# EAGLE design digimax-dual-IDE64 (EAGLE 4.13)
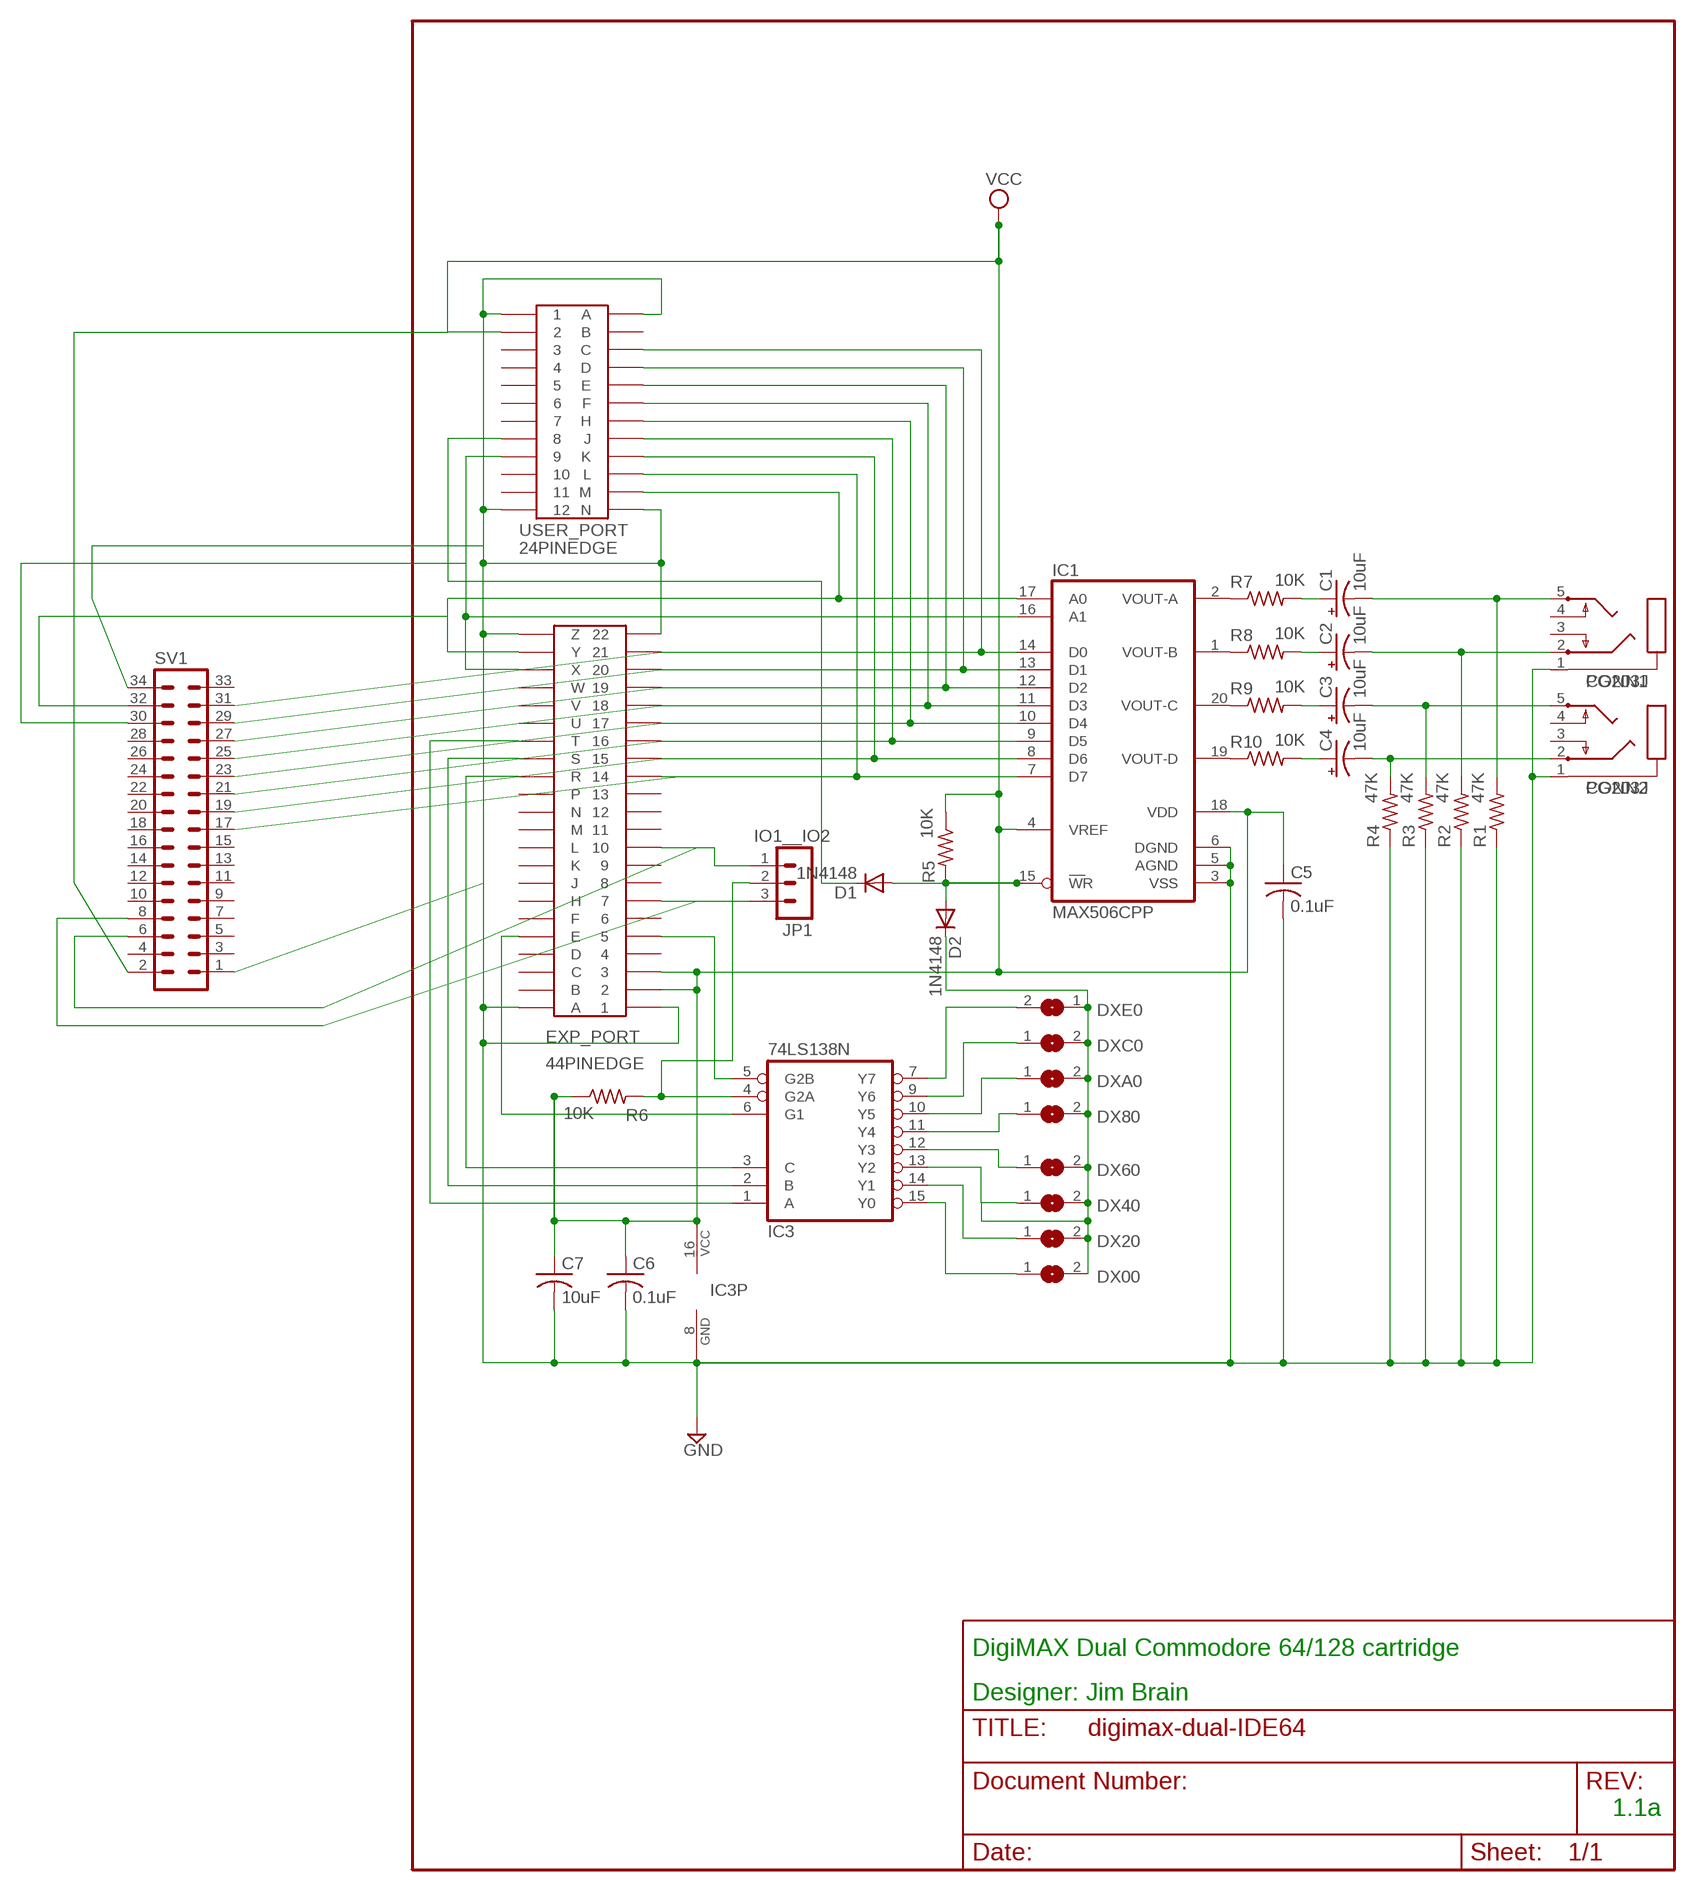
[diagram p0: schematic, sheet 1]

## Parts
C1  10uF  CPOL-USE2-4  [E2-4]
C2  10uF  CPOL-USE2-4  [E2-4]
C3  10uF  CPOL-USE2-4  [E2-4]
C4  10uF  CPOL-USE2-4  [E2-4]
C5  0.1uF  C-US025-024X044  [C025-024X044]
C6  0.1uF  C-US025-024X044  [C025-024X044]
C7  10uF  C-US025-025X050  [C025-025X050]
CONN1  PG203J  [PG203J]
CONN2  PG203J  [PG203J]
D1  1N4148  DIODE-D-2.5  [D-2.5]
D2  1N4148  DIODE-D-2.5  [D-2.5]
DX00  SJ  [SJ]
DX20  SJ  [SJ]
DX40  SJ  [SJ]
DX60  SJ  [SJ]
DX80  SJ  [SJ]
DXA0  SJ  [SJ]
DXC0  SJ  [SJ]
DXE0  SJ  [SJ]
EXP_PORT  44PINEDGE  [44PINEDGE]
IC1  MAX506CPP  [DIL20]
IC3  74LS138N  [DIL16]
JP1  IO1__IO2  MA03-1  [MA03-1]
R1  47K  R-US_0207/2V  [0207/2V]
R2  47K  R-US_0207/2V  [0207/2V]
R3  47K  R-US_0207/2V  [0207/2V]
R4  47K  R-US_0207/2V  [0207/2V]
R5  10K  R-US_0204/7  [0204/7]
R6  10K  R-US_0207/2V  [0207/2V]
R7  10K  R-US_0207/2V  [0207/2V]
R8  10K  R-US_0207/2V  [0207/2V]
R9  10K  R-US_0207/2V  [0207/2V]
R10  10K  R-US_0207/2V  [0207/2V]
SV1  MA17-2  [MA17-2]
USER_PORT  24PINEDGE  [24PINEDGE]

## Nets
GND: C5.2 C6.2 C7.2 CONN1.1 CONN2.1 EXP_PORT.1 EXP_PORT.22 EXP_PORT.A EXP_PORT.Z IC1.3(VSS) IC1.5(AGND) IC1.6(DGND) IC3.8(GND) R1.1 R2.1 R3.1 R4.1 SV1.1 SV1.34 USER_PORT.1 USER_PORT.12 USER_PORT.A USER_PORT.N
N$1: EXP_PORT.21 IC1.14(D0) SV1.31 USER_PORT.C
N$2: EXP_PORT.20 IC1.13(D1) SV1.29 USER_PORT.D
N$3: EXP_PORT.19 IC1.12(D2) SV1.27 USER_PORT.E
N$4: EXP_PORT.18 IC1.11(D3) SV1.25 USER_PORT.F
N$5: EXP_PORT.17 IC1.10(D4) SV1.23 USER_PORT.H
N$6: EXP_PORT.16 IC1.9(D5) SV1.21 USER_PORT.J
N$7: EXP_PORT.15 IC1.8(D6) SV1.19 USER_PORT.K
N$8: EXP_PORT.14 IC1.7(D7) SV1.17 USER_PORT.L
N$9: EXP_PORT.Y IC1.17(A0) SV1.32 USER_PORT.M
N$10: DXE0.2 IC3.7(Y7)
N$11: EXP_PORT.X IC1.16(A1) SV1.30 USER_PORT.9
N$12: EXP_PORT.10 JP1.1 SV1.6
N$13: D1.C USER_PORT.8
N$15: EXP_PORT.T IC3.1(A)
N$16: IC3.4(G2A) JP1.2 R6.2
N$17: C1.+ R7.2
N$18: C2.+ R8.2
N$19: C3.+ R9.2
N$20: C4.+ R10.2
N$21: C4.- CONN2.2 R4.2
N$22: C3.- CONN2.5 R3.2
N$23: C2.- CONN1.2 R2.2
N$24: C1.- CONN1.5 R1.2
N$25: EXP_PORT.S IC3.2(B)
N$26: EXP_PORT.R IC3.3(C)
N$27: DXC0.1 IC3.9(Y6)
N$28: EXP_PORT.5 IC3.5(G2B)
N$29: DXA0.1 IC3.10(Y5)
N$30: DX80.1 IC3.11(Y4)
N$31: DX60.1 IC3.12(Y3)
N$32: D2.C DX00.2 DX20.2 DX40.1 DX40.2 DX60.2 DX80.2 DXA0.2 DXC0.2 DXE0.1 IC3.13(Y2)
N$33: DX20.1 IC3.14(Y1)
N$34: DX00.1 IC3.15(Y0)
N$36: IC1.2(VOUT-A) R7.1
N$37: IC1.1(VOUT-B) R8.1
N$38: IC1.20(VOUT-C) R9.1
N$39: IC1.19(VOUT-D) R10.1
N$40: EXP_PORT.E IC3.6(G1)
N$41: D1.A D2.A IC1.15(WR) R5.2
N$43: EXP_PORT.7 JP1.3 SV1.8
VCC: C5.1 C6.1 C7.1 EXP_PORT.2 EXP_PORT.3 IC1.4(VREF) IC1.18(VDD) IC3.16(VCC) R5.1 R6.1 SV1.2 USER_PORT.2
Unconnected: CONN1.3 CONN1.4 CONN2.3 CONN2.4 EXP_PORT.4 EXP_PORT.6 EXP_PORT.8 EXP_PORT.9 EXP_PORT.11 EXP_PORT.12 EXP_PORT.13 EXP_PORT.B EXP_PORT.C EXP_PORT.D EXP_PORT.F EXP_PORT.H EXP_PORT.J EXP_PORT.K EXP_PORT.L EXP_PORT.M EXP_PORT.N EXP_PORT.P EXP_PORT.U EXP_PORT.V EXP_PORT.W SV1.3 SV1.4 SV1.5 SV1.7 SV1.9 SV1.10 SV1.11 SV1.12 SV1.13 SV1.14 SV1.15 SV1.16 SV1.18 SV1.20 SV1.22 SV1.24 SV1.26 SV1.28 SV1.33 USER_PORT.3 USER_PORT.4 USER_PORT.5 USER_PORT.6 USER_PORT.7 USER_PORT.10 USER_PORT.11 USER_PORT.B

## Notes on the sheet
- DigiMAX Dual Commodore 64/128 cartridge
- Designer: Jim Brain
- 1.1a

## Library data of the parts
C1-C4 = rcl:CPOL-US: POLARIZED CAPACITOR, American symbol
C5-C7 = rcl:C-US: CAPACITOR, American symbol
CONN1 CONN2 = con-hirschmann:PG203J: MIC/HEADPHONE JACK KS-S stereo microphone/headphone jack PG203JN (Schukat)
D1 D2 = diode:DIODE-: DIODE
DX00 DX20 DX40 DX60 DX80 DXA0 DXC0 DXE0 = jumper:SJ: SMD solder JUMPER
EXP_PORT = edge-100:44PINEDGE: 44 PIN EDGE CONNECTOR FOR PCB
IC1 = maxim:MAX506CPP: DIGITAL/ANALOG CONVERTER
IC3 = 74xx-us:74*138: 3-line to 8-line DECODER/DEMULTIPLEXER
JP1 = con-lstb:MA03-1: PIN HEADER
R1-R10 = rcl:R-US_: RESISTOR, American symbol
SV1 = con-lstb:MA17-2: PIN HEADER
USER_PORT = edge-156:24PINEDGE

## Board
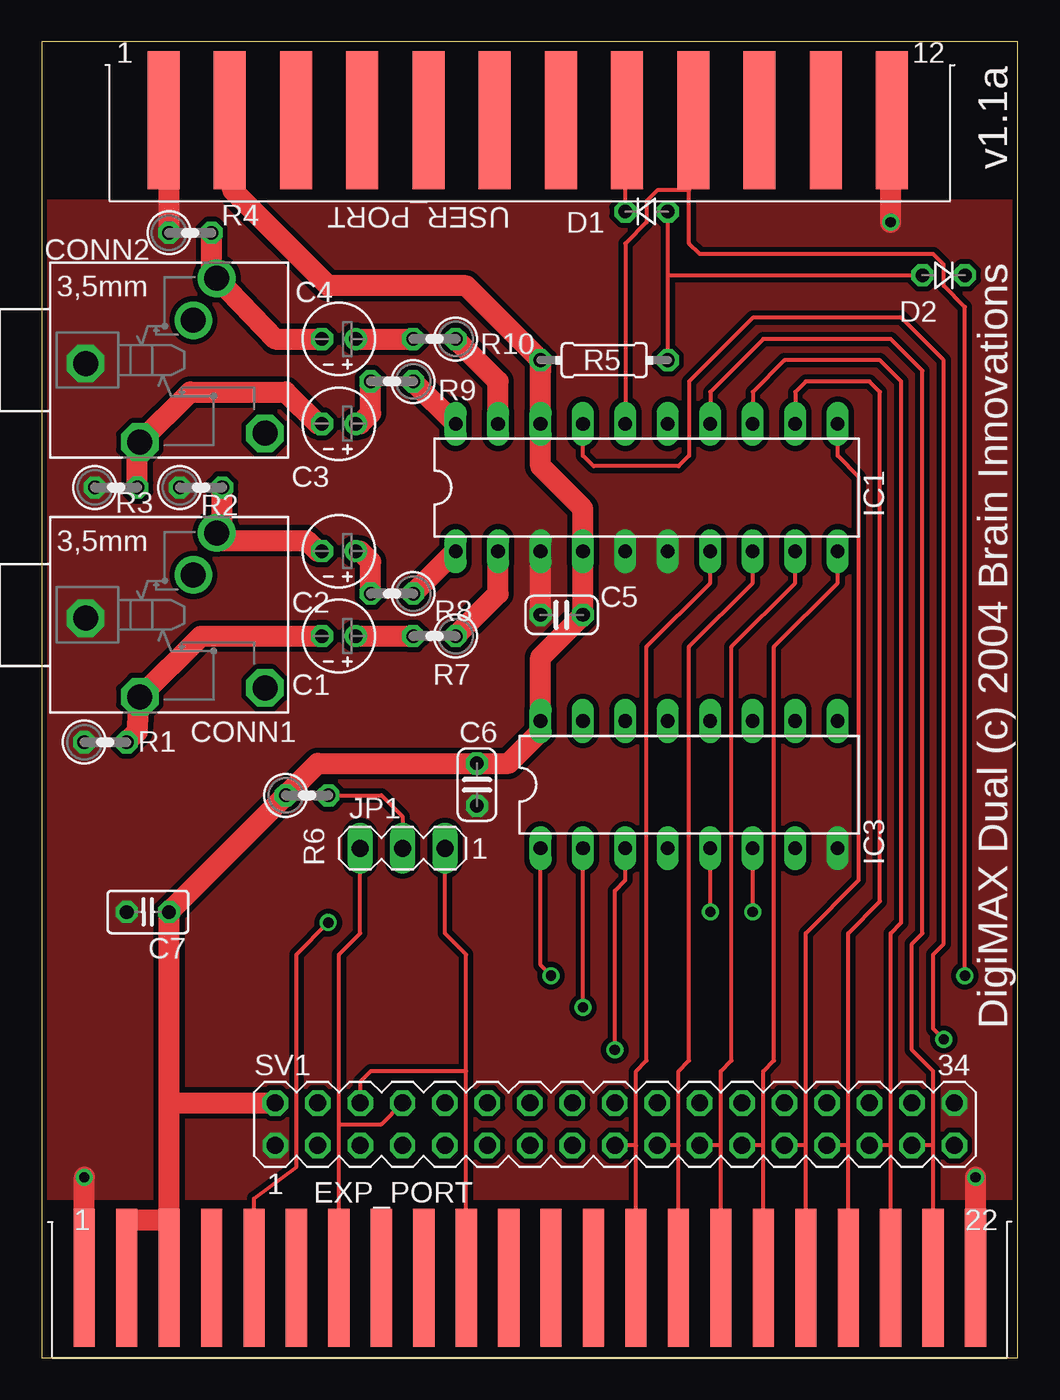
[diagram p1: board, top side]
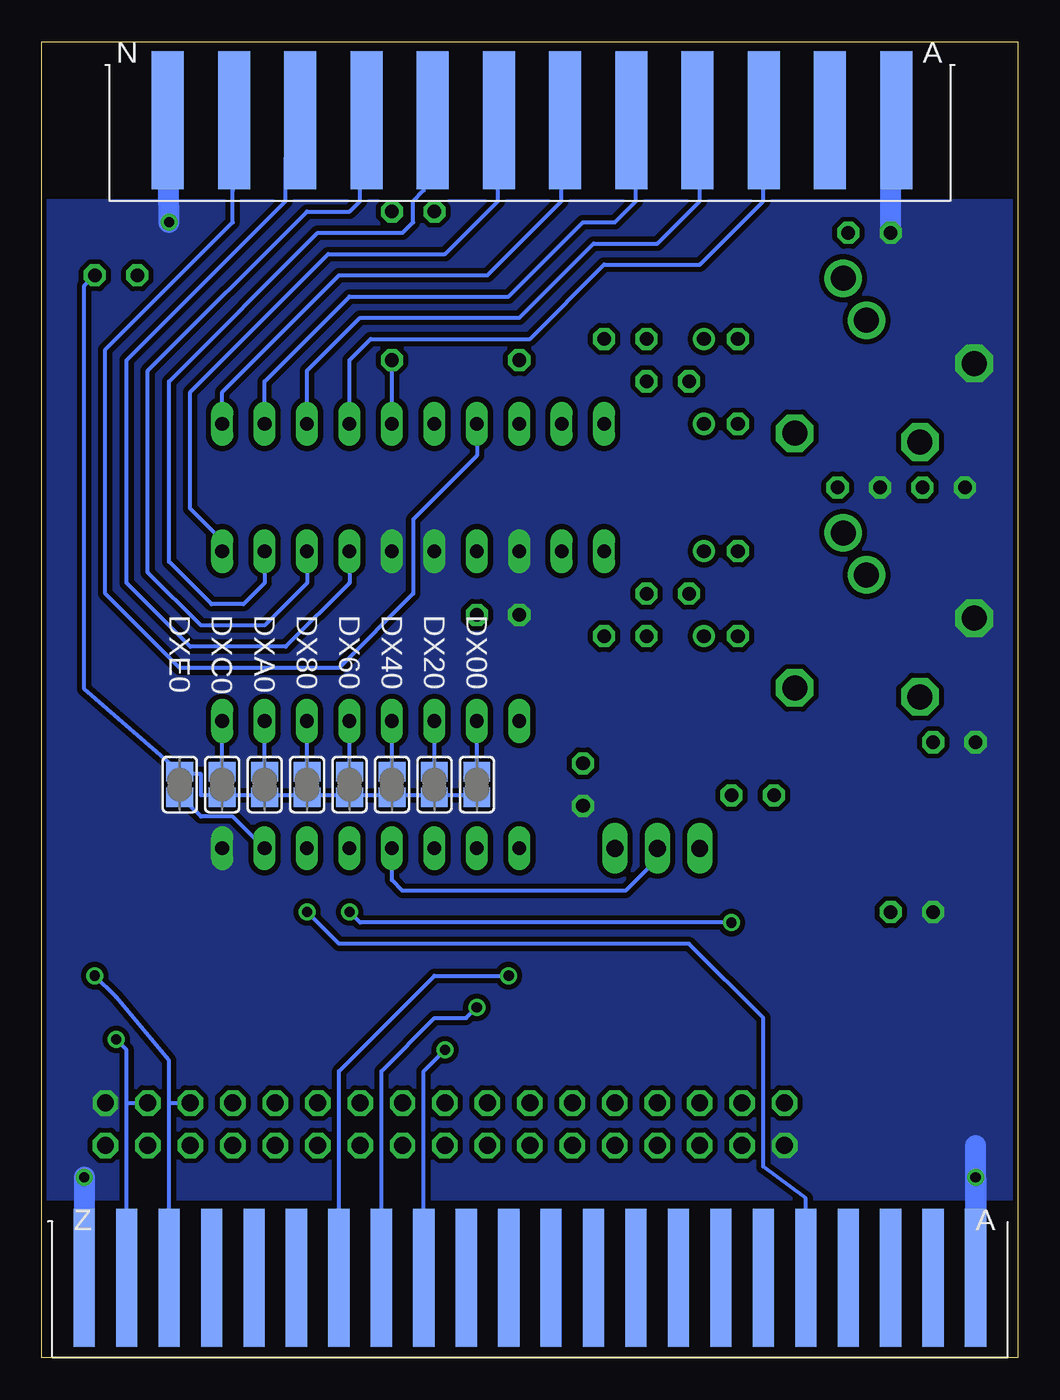
[diagram p2: board, bottom side, seen from below]

Size 58.42 x 78.74 mm. Coordinates in mm from the lower left corner, seen from the top.
Outline: 0.17,0.01 58.26,0.01 58.42,0 58.42,78.74 58.26,78.73 0.17,78.73 0,78.74 0,0 0.17,0.01
Copper layers (1*16): Top 0.035mm / dielectric 1.5mm / Bottom 0.035mm
Design rules "default": minimum track width 10mil, minimum drill 24mil, track to track 12mil, track to pad 12mil, pad to pad 12mil, via to via 12mil, smd to smd 12mil, copper to edge 12mil, drill to drill 8mil, minimum pad ring 10mil, minimum via ring 8mil, stop-mask expansion 4mil, vias tented up to drill 0mil, thermal gap 10mil

### Footprints (pad centres in the part's own frame; a part is rotated, then mirrored left to right if it is on the bottom)
E2-4 = drill 0.813 pad 1.27 round: + -1.016,0 | drill 0.813 pad 1.27 octagon: - 1.016,0
C025-024X044 = drill 0.813 octagon: 1 -1.27,0; 2 1.27,0
C025-025X050 = drill 0.813 octagon: 1 -1.27,0; 2 1.27,0
PG203J = drill 1.499 octagon: 1 -5.004,-0.203; 4 5.74,-4.369; 5 -1.753,-4.902 | drill 1.499 round: 2 2.845,4.902; 3 1.448,2.388
D-2.5 = drill 0.813 octagon: A 1.27,0; C -1.27,0
SJ = smd 1.168 x 1.6: 1 -0.762,0; 2 0.762,0
44PINEDGE = smd 1.27 x 8.255: 1 -24.765,-0.305; 2 -22.225,-0.305; 3 -19.685,-0.305; 4 -17.145,-0.305; 5 -14.605,-0.305; 6 -12.065,-0.305; 7 -9.525,-0.305; 8 -6.985,-0.305; 9 -4.445,-0.305; 10 -1.905,-0.305; 11 0.635,-0.305; 12 3.175,-0.305; 13 5.715,-0.305; 14 8.255,-0.305; 15 10.795,-0.305; 16 13.335,-0.305; 17 15.875,-0.305; 18 18.415,-0.305; 19 20.955,-0.305; 20 23.495,-0.305; 21 26.035,-0.305; 22 28.575,-0.305 | smd 1.27 x 8.255 bottom: A -24.765,-0.305; B -22.225,-0.305; C -19.685,-0.305; D -17.145,-0.305; E -14.605,-0.305; F -12.065,-0.305; H -9.525,-0.305; J -6.985,-0.305; K -4.445,-0.305; L -1.905,-0.305; M 0.635,-0.305; N 3.175,-0.305; P 5.715,-0.305; R 8.255,-0.305; S 10.795,-0.305; T 13.335,-0.305; U 15.875,-0.305; V 18.415,-0.305; W 20.955,-0.305; X 23.495,-0.305; Y 26.035,-0.305; Z 28.575,-0.305
DIL20 = drill 0.813 long: 1 -11.43,-3.81; 2 -8.89,-3.81; 3 -6.35,-3.81; 4 -3.81,-3.81; 5 -1.27,-3.81; 6 1.27,-3.81; 7 3.81,-3.81; 8 6.35,-3.81; 9 8.89,-3.81; 10 11.43,-3.81; 11 11.43,3.81; 12 8.89,3.81; 13 6.35,3.81; 14 3.81,3.81; 15 1.27,3.81; 16 -1.27,3.81; 17 -3.81,3.81; 18 -6.35,3.81; 19 -8.89,3.81; 20 -11.43,3.81
DIL16 = drill 0.813 long: 1 -8.89,-3.81; 2 -6.35,-3.81; 3 -3.81,-3.81; 4 -1.27,-3.81; 5 1.27,-3.81; 6 3.81,-3.81; 7 6.35,-3.81; 8 8.89,-3.81; 9 8.89,3.81; 10 6.35,3.81; 11 3.81,3.81; 12 1.27,3.81; 13 -1.27,3.81; 14 -3.81,3.81; 15 -6.35,3.81; 16 -8.89,3.81
MA03-1 = drill 1.016 long: 1 -2.54,0; 2 0,0; 3 2.54,0
0207/2V = drill 0.813 octagon: 1 -1.27,0; 2 1.27,0
0204/7 = drill 0.813 octagon: 1 -3.81,0; 2 3.81,0
MA17-2 = drill 1.016 octagon: 1 -20.32,-1.27; 2 -20.32,1.27; 3 -17.78,-1.27; 4 -17.78,1.27; 5 -15.24,-1.27; 6 -15.24,1.27; 7 -12.7,-1.27; 8 -12.7,1.27; 9 -10.16,-1.27; 10 -10.16,1.27; 11 -7.62,-1.27; 12 -7.62,1.27; 13 -5.08,-1.27; 14 -5.08,1.27; 15 -2.54,-1.27; 16 -2.54,1.27; 17 0,-1.27; 18 0,1.27; 19 2.54,-1.27; 20 2.54,1.27; 21 5.08,-1.27; 22 5.08,1.27; 23 7.62,-1.27; 24 7.62,1.27; 25 10.16,-1.27; 26 10.16,1.27; 27 12.7,-1.27; 28 12.7,1.27; 29 15.24,-1.27; 30 15.24,1.27; 31 17.78,-1.27; 32 17.78,1.27; 33 20.32,-1.27; 34 20.32,1.27
24PINEDGE = smd 1.905 x 8.255: 1 -21.285,-0.254; 2 -17.323,-0.254; 3 -13.36,-0.254; 4 -9.398,-0.254; 5 -5.436,-0.254; 6 -1.473,-0.254; 7 2.489,-0.254; 8 6.452,-0.254; 9 10.414,-0.254; 10 14.376,-0.254; 11 18.339,-0.254; 12 22.301,-0.254 | smd 1.905 x 8.255 bottom: A -21.285,-0.254; B -17.323,-0.254; C -13.36,-0.254; D -9.398,-0.254; E -5.436,-0.254; F -1.473,-0.254; H 2.489,-0.254; J 6.452,-0.254; K 10.414,-0.254; L 14.376,-0.254; M 18.339,-0.254; N 22.301,-0.254

### Placement (x,y rotation side)
C1  17.78,43.18 180 top
C2  17.78,48.26 180 top
C3  17.78,55.88 180 top
C4  17.78,60.96 180 top
C5  31.11,44.45 180 top
C6  26.04,34.29 270 top
C7  6.35,26.67 180 top
CONN1  7.62,44.45 0 top
CONN2  7.62,59.69 0 top
D1  36.2,68.58 0 top
D2  53.98,64.77 180 top
DX00  32.38,34.29 270 bottom
DX20  34.92,34.29 270 bottom
DX40  37.47,34.29 270 bottom
DX60  40.01,34.29 270 bottom
DX80  42.55,34.29 270 bottom
DXA0  45.09,34.29 270 bottom
DXC0  47.62,34.29 270 bottom
DXE0  50.16,34.29 270 bottom
EXP_PORT  27.3,5.08 0 top
IC1  36.2,52.07 0 top
IC3  38.73,34.29 0 top
JP1  21.59,30.48 180 top
R1  3.81,36.83 0 top
R2  9.53,52.07 0 top
R3  4.45,52.07 0 top
R4  8.89,67.31 0 top
R5  33.66,59.69 0 top
R6  15.88,33.66 0 top
R7  23.5,43.18 180 top
R8  20.95,45.72 180 top
R9  20.95,58.42 180 top
R10  23.5,60.96 180 top
SV1  34.29,13.97 0 top
USER_PORT  28.57,74.3 0 top

### Tracks (layer width: path | path; a pad name or v marks a point on that pad's centre or on a via)
GND  (via drill 0.61)
  Top 1.27: C5.2 IC1.3 | EXP_PORT.22 v55.88,10.79 | USER_PORT.N 50.8,74.04 v50.8,67.94 | EXP_PORT.1 v2.54,10.79 | R4.1 7.62,70.48 USER_PORT.A
  Bottom 1.27: R4.1 7.62,70.48 USER_PORT.A | v55.88,10.79 EXP_PORT.22 | 2.54,12.7 EXP_PORT.1 v2.54,10.79 | v50.8,67.94 USER_PORT.N
  pour Bottom (no thermals): 0,69.22 58.42,69.22 58.42,9.53 0,9.53
  pour Top (no thermals): 0,69.22 58.42,69.22 58.42,9.53 0,9.53
N$1
  Top 0.254: EXP_PORT.21 53.34,12.7 | 53.34,12.7 53.34,17.14 52.07,18.41 52.07,24.77 52.7,25.4 52.7,59.05 50.8,60.96 43.18,60.96 40.01,57.78 IC1.14 | 53.34,12.7 SV1.31
  Bottom 0.254: USER_PORT.C 15.24,71.12 15.24,69.22 19.05,65.41 24.77,65.41 29.21,60.96 38.73,60.96 40.01,59.69 IC1.14
N$2
  Top 0.254: EXP_PORT.20 50.8,12.7 | 50.8,12.7 50.8,25.4 51.44,26.04 51.44,58.42 50.16,59.69 44.45,59.69 42.55,57.78 IC1.13 | 50.8,12.7 SV1.29
  Bottom 0.254: USER_PORT.D 19.05,71.12 19.05,69.22 21.59,66.67 25.4,66.67 29.84,62.23 39.37,62.23 42.55,59.05 IC1.13
N$3
  Top 0.254: EXP_PORT.19 48.26,12.7 | 48.26,12.7 48.26,25.4 50.16,27.3 50.16,57.78 49.53,58.42 45.72,58.42 45.09,57.78 IC1.12 | 48.26,12.7 SV1.27
  Bottom 0.254: USER_PORT.E 22.86,70.48 22.86,69.22 24.13,67.94 26.04,67.94 30.48,63.5 40.01,63.5 45.09,58.42 IC1.12
N$4
  Top 0.254: EXP_PORT.18 45.72,12.7 | 45.72,12.7 45.72,25.4 48.9,28.57 48.9,52.7 47.62,53.98 IC1.11 | 45.72,12.7 SV1.25
  Bottom 0.254: USER_PORT.F 27.3,71.12 27.3,69.22 31.75,64.77 40.64,64.77 47.62,57.78 IC1.11
N$5
  Top 0.254: EXP_PORT.17 43.18,12.7 | 43.18,12.7 43.18,17.14 43.81,17.78 43.81,42.55 47.62,46.35 IC1.10 | 43.18,12.7 SV1.23
  Bottom 0.254: USER_PORT.H 31.11,69.22 34.29,66.04 41.27,66.04 49.53,57.78 49.53,50.8 47.62,48.9 IC1.10
N$6
  Top 0.254: EXP_PORT.16 40.64,12.7 | 40.64,12.7 40.64,17.14 41.27,17.78 41.27,42.55 45.09,46.35 IC1.9 | 40.64,12.7 SV1.21
  Bottom 0.254: USER_PORT.J 35.56,69.85 36.2,69.22 36.2,67.94 36.83,67.31 41.91,67.31 50.8,58.42 50.8,47.62 48.26,45.09 46.35,45.09 45.09,46.35 IC1.9
N$7
  Top 0.254: EXP_PORT.15 38.1,12.7 | 38.1,12.7 38.1,17.14 38.73,17.78 38.73,42.55 42.55,46.35 IC1.8 | 38.1,12.7 SV1.19
  Bottom 0.254: USER_PORT.K 39.37,70.48 39.37,69.22 40.01,68.58 42.55,68.58 52.07,59.05 52.07,46.99 48.9,43.81 45.09,43.81 42.55,46.35 IC1.8
N$8
  Top 0.254: EXP_PORT.14 35.56,12.7 | 35.56,12.7 35.56,17.14 36.2,17.78 36.2,42.55 40.01,46.35 IC1.7 | 35.56,12.7 SV1.17
  Bottom 0.254: USER_PORT.L 43.81,71.75 43.81,69.22 53.34,59.69 53.34,46.35 49.53,42.55 43.81,42.55 40.01,46.35 IC1.7
N$9  (via drill 0.61)
  Top 0.254: v53.98,19.05 53.34,19.68 53.34,24.13 53.98,24.77 53.98,59.69 51.44,62.23 42.55,62.23 38.73,58.42 38.73,53.98 38.1,53.34 33.02,53.34 32.38,53.98 IC1.17
  Bottom 0.254: USER_PORT.M 46.99,69.85 46.99,67.94 54.61,60.33 54.61,45.72 50.16,41.27 40.64,41.27 36.2,45.72 36.2,50.16 32.38,53.98 IC1.17 | EXP_PORT.Y 53.34,15.24 | 53.34,15.24 53.34,18.41 v53.98,19.05 | 53.34,15.24 SV1.32
N$10
  Bottom 0.254: DXE0.2 49.53,33.02 48.9,32.38 46.99,32.38 IC3.7
N$11  (via drill 0.61)
  Top 0.254: 38.73,69.85 36.83,69.85 36.2,69.22 36.2,67.94 34.92,66.67 IC1.16 | v55.24,22.86 55.24,62.87 53.98,64.14 53.98,65.41 53.34,66.04 39.37,66.04 38.73,66.67 38.73,69.85 | 38.73,69.85 USER_PORT.9
  Bottom 0.254: EXP_PORT.X 50.8,15.24 | 50.8,15.24 50.8,17.78 53.98,21.59 v55.24,22.86 | 50.8,15.24 SV1.30
N$12
  Top 0.254: JP1.1 24.13,25.4 25.4,24.13 25.4,17.14 | EXP_PORT.10 25.4,17.14 | SV1.6 19.05,16.51 19.68,17.14 25.4,17.14
N$13
  Top 0.254: D1.C 34.92,70.48 34.29,70.48 USER_PORT.8
N$15  (via drill 0.61)
  Top 0.254: v30.48,22.86 29.84,23.5 IC3.1
  Bottom 0.254: v30.48,22.86 34.92,22.86 40.64,17.14 EXP_PORT.T
N$16
  Top 0.254: R6.2 20.32,33.66 21.59,32.38 JP1.2
  Bottom 0.254: IC3.4 37.47,28.57 36.83,27.94 23.5,27.94 21.59,29.84 JP1.2
N$17
  Top 1.27: C1.+ R7.2
N$18
  Top 1.27: C2.+ 19.05,48.26 19.68,47.62 R8.2
N$19
  Top 1.27: C3.+ 19.05,55.88 19.68,56.52 R9.2
N$20
  Top 1.27: C4.+ R10.2
N$21
  Top 1.27: R4.2 10.16,64.77 CONN2.2 13.97,60.96 C4.-
N$22
  Top 1.27: R3.2 5.71,54.61 CONN2.5 8.89,57.78 14.61,57.78 16.51,55.88 C3.-
N$23
  Top 1.27: C2.- 16.51,48.26 15.88,48.9 10.79,48.9 CONN1.2 10.79,49.53 R2.2
N$24
  Top 1.27: C1.- 9.53,43.18 CONN1.5 5.71,37.47 R1.2
N$25  (via drill 0.61)
  Top 0.254: v32.38,20.95 IC3.2
  Bottom 0.254: v32.38,20.95 33.02,20.32 34.92,20.32 38.1,17.14 EXP_PORT.S
N$26  (via drill 0.61)
  Top 0.254: v34.29,18.41 34.29,27.94 34.92,28.57 IC3.3
  Bottom 0.254: EXP_PORT.R 35.56,17.14 v34.29,18.41
N$27
  Bottom 0.254: DXC0.1 IC3.9
N$28  (via drill 0.61)
  Top 0.254: v17.14,26.04 15.24,24.13 15.24,11.43 12.7,9.53 EXP_PORT.5 | v40.01,26.67 IC3.5
  Bottom 0.254: v17.14,26.04 39.37,26.04 v40.01,26.67
N$29
  Bottom 0.254: DXA0.1 IC3.10
N$30
  Bottom 0.254: DX80.1 IC3.11
N$31
  Bottom 0.254: DX60.1 IC3.12
N$32
  Bottom 0.254: IC3.13 DX40.1 DX40.2 | DX00.2 33.02,33.66 34.29,33.66 DX20.2 35.56,33.66 36.83,33.66 DX40.2 | DX40.2 38.1,33.66 39.37,33.66 DX60.2 40.64,33.66 41.91,33.66 DX80.2 43.18,33.66 44.45,33.66 DXA0.2 45.72,33.66 46.99,33.66 DXC0.2 48.26,33.66 48.9,33.66 48.9,34.92 49.53,34.92 DXE0.1 | D2.C 55.88,64.14 55.88,40.01 DXE0.1 | DXE0.1 50.16,34.92
N$33
  Bottom 0.254: DX20.1 IC3.14
N$34
  Bottom 0.254: DX00.1 IC3.15
N$36
  Top 1.27: IC1.2 27.3,45.72 R7.1
N$37
  Top 1.27: R8.1 IC1.1
N$38
  Top 1.27: R9.1 IC1.20
N$39
  Top 1.27: IC1.19 27.3,58.42 R10.1
N$40  (via drill 0.61)
  Top 0.254: v42.55,26.67 IC3.6
  Bottom 0.254: v42.55,26.67 40.64,24.77 19.68,24.77 15.24,20.32 15.24,11.43 12.7,9.53 EXP_PORT.E
N$41
  Top 0.254: 37.47,64.77 D2.A | R5.2 37.47,64.77 | 37.47,64.77 D1.A
  Bottom 0.254: IC1.15 R5.2
N$43
  Top 0.254: JP1.3 19.05,25.4 17.78,24.13 17.78,13.97 | EXP_PORT.7 17.78,13.97 | SV1.8 20.32,13.97 17.78,13.97
VCC
  Top 1.27: 7.62,8.26 5.08,8.26 EXP_PORT.2 | USER_PORT.2 11.43,69.85 17.14,64.14 25.4,64.14 R5.1 | R5.1 IC1.18 29.84,53.34 32.38,50.8 IC1.4 C5.1 29.84,41.91 IC3.16 29.84,37.47 27.94,35.56 C6.1 16.51,35.56 R6.1 C7.1 7.62,15.24 | 7.62,8.26 7.62,15.24 | 7.62,8.26 EXP_PORT.3 | R5.1 29.84,59.05 | 7.62,15.24 SV1.2

### Text on the board
tPlace: v1.1a | DigiMAX Dual (c) 2004 Brain Innovations